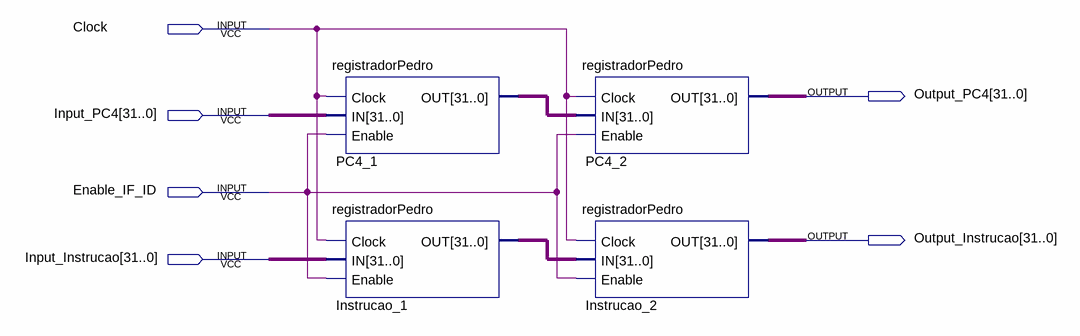
[diagram p0: schematic sheet]
// Quartus schematic barreira_IF_ID.bdf as structural Verilog: 4 symbols, 6 pins
module barreira_IF_ID (
  input  Clock,
  input  [31:0] Input_PC4,
  input  Enable_IF_ID,
  input  [31:0] Input_Instrucao,
  output [31:0] Output_PC4,
  output [31:0] Output_Instrucao
);

  wire [31:0] Instrucao_1_out, PC4_1_out;

  registradorPedro PC4_1 (.Clock(Clock), .IN(Input_PC4), .Enable(Enable_IF_ID), .OUT(PC4_1_out));
  registradorPedro Instrucao_1 (.Clock(Clock), .IN(Input_Instrucao), .Enable(Enable_IF_ID), .OUT(Instrucao_1_out));
  registradorPedro PC4_2 (.Clock(Clock), .IN(PC4_1_out), .Enable(Enable_IF_ID), .OUT(Output_PC4));
  registradorPedro Instrucao_2 (.Clock(Clock), .IN(Instrucao_1_out), .Enable(Enable_IF_ID), .OUT(Output_Instrucao));
endmodule
